# EAGLE schematic io_breakout-ver2.1 (EAGLE 9.4.2)

## Sheet 1 of 4
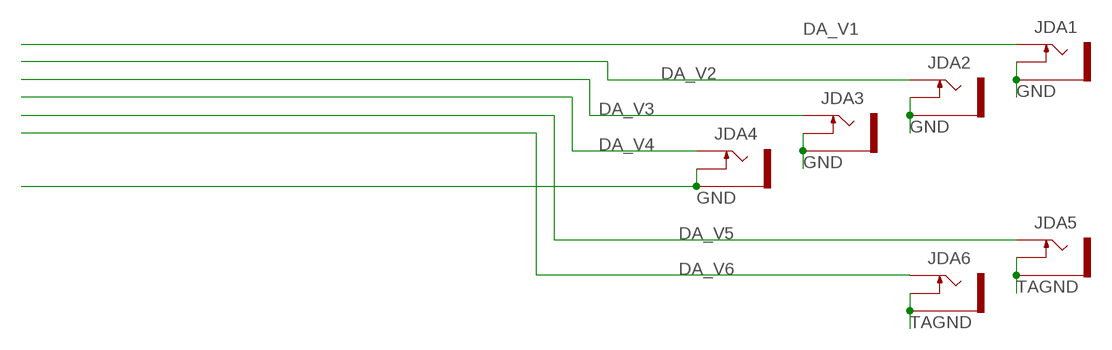
[diagram p0: schematic, sheet 1]

### Parts
JDA1  THONKICONNNEW  [WQP-PJ301M-12_JACK]
JDA2  THONKICONNNEW  [WQP-PJ301M-12_JACK]
JDA3  THONKICONNNEW  [WQP-PJ301M-12_JACK]
JDA4  THONKICONNNEW  [WQP-PJ301M-12_JACK]
JDA5  THONKICONNNEW  [WQP-PJ301M-12_JACK]
JDA6  THONKICONNNEW  [WQP-PJ301M-12_JACK]

### Nets
DA_V1 [defaultxx]: JDA1.P$1_TIP(TIP) ; also sheet 3
DA_V2 [defaultxx]: JDA2.P$1_TIP(TIP) ; also sheet 3
DA_V3 [defaultxx]: JDA3.P$1_TIP(TIP) ; also sheet 3
DA_V4 [defaultxx]: JDA4.P$1_TIP(TIP) ; also sheet 3
DA_V5: JDA5.P$1_TIP(TIP) ; also sheet 3
DA_V6: JDA6.P$1_TIP(TIP) ; also sheet 3
GND: JDA1.P$2_SWITCH(SWITCH) JDA1.P$3_SLEEVE(SLEEVE) JDA2.P$2_SWITCH(SWITCH) JDA2.P$3_SLEEVE(SLEEVE) JDA3.P$2_SWITCH(SWITCH) JDA3.P$3_SLEEVE(SLEEVE) JDA4.P$2_SWITCH(SWITCH) JDA4.P$3_SLEEVE(SLEEVE) ; also sheet 2,3,4
TAGND: JDA5.P$2_SWITCH(SWITCH) JDA5.P$3_SLEEVE(SLEEVE) JDA6.P$2_SWITCH(SWITCH) JDA6.P$3_SLEEVE(SLEEVE) ; also sheet 2,3

## Sheet 2 of 4
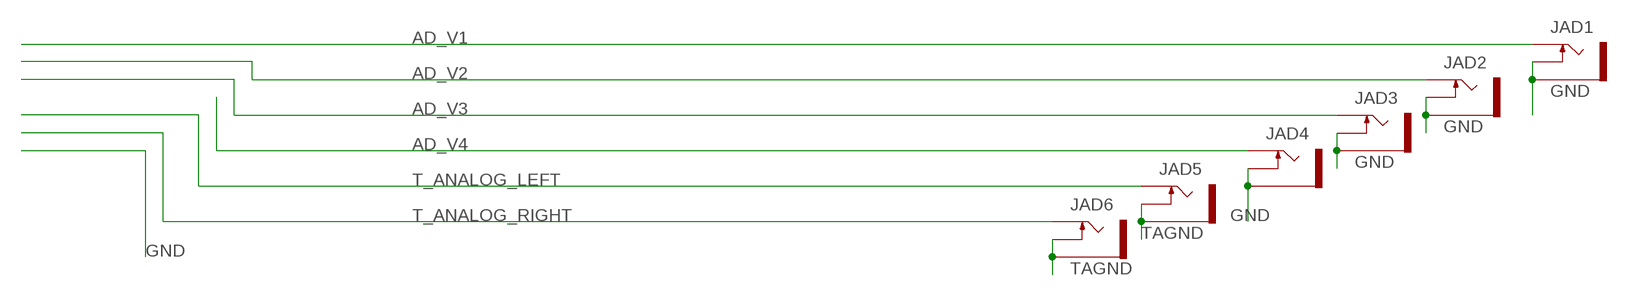
[diagram p1: schematic, sheet 2]

### Parts
JAD1  THONKICONNNEW  [WQP-PJ301M-12_JACK]
JAD2  THONKICONNNEW  [WQP-PJ301M-12_JACK]
JAD3  THONKICONNNEW  [WQP-PJ301M-12_JACK]
JAD4  THONKICONNNEW  [WQP-PJ301M-12_JACK]
JAD5  THONKICONNNEW  [WQP-PJ301M-12_JACK]
JAD6  THONKICONNNEW  [WQP-PJ301M-12_JACK]

### Nets
AD_V1: JAD1.P$1_TIP(TIP) ; also sheet 3
AD_V2 [defaultxx]: JAD2.P$1_TIP(TIP) ; also sheet 3
AD_V3 [defaultxx]: JAD3.P$1_TIP(TIP) ; also sheet 3
AD_V4 [defaultxx]: JAD4.P$1_TIP(TIP) ; also sheet 3
GND: JAD1.P$2_SWITCH(SWITCH) JAD1.P$3_SLEEVE(SLEEVE) JAD2.P$2_SWITCH(SWITCH) JAD2.P$3_SLEEVE(SLEEVE) JAD3.P$2_SWITCH(SWITCH) JAD3.P$3_SLEEVE(SLEEVE) JAD4.P$2_SWITCH(SWITCH) JAD4.P$3_SLEEVE(SLEEVE) ; also sheet 1,3,4
T_ANALOG_LEFT: JAD5.P$1_TIP(TIP) ; also sheet 3
T_ANALOG_RIGHT: JAD6.P$1_TIP(TIP) ; also sheet 3
TAGND: JAD5.P$2_SWITCH(SWITCH) JAD5.P$3_SLEEVE(SLEEVE) JAD6.P$2_SWITCH(SWITCH) JAD6.P$3_SLEEVE(SLEEVE) ; also sheet 1,3

## Sheet 3 of 4
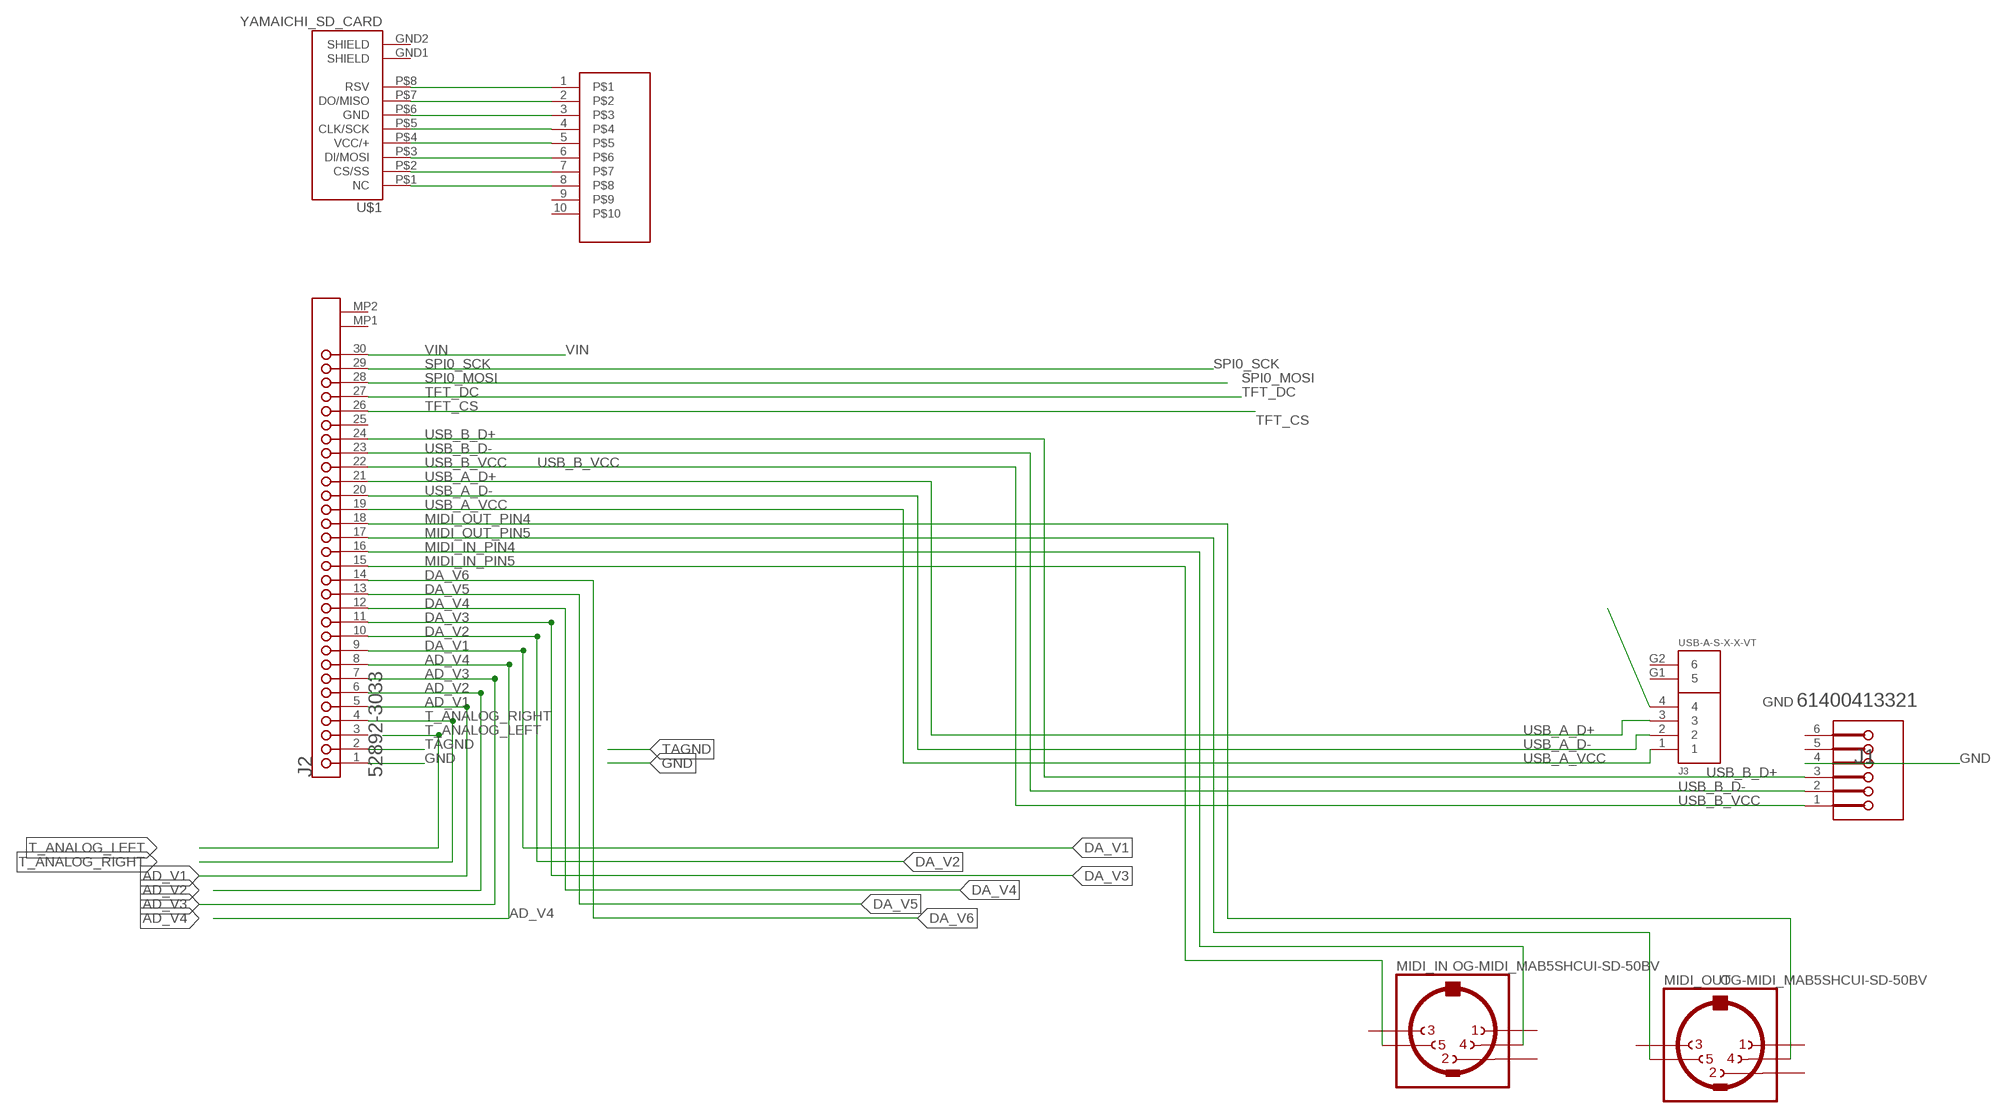
[diagram p2: schematic, sheet 3]

### Parts
J1  WURTH_ELECTRONICS_61400413321WURTH_ELECTRONICS_61400413321_0_0  [WURTH_ELECTRONICS_61400413321_0]
J2  MOLEX_52892-3033MOLEX_52892-3033_0_0  [MOLEX_52892-3033_0]
J3  USB-A-S-X-X-VT  [USB-A-S-X-X-VT]
MIDI_IN  OG-MIDI_MAB5SHCUI-SD-50BV  [OG-MIDI_SD-50BV]
MIDI_OUT  OG-MIDI_MAB5SHCUI-SD-50BV  [OG-MIDI_SD-50BV]
U$1  YAMAICHI_SD_CARD  [YAMAICHI_MICROSD_VERTICAL]
U$2  1734592-8  [TE_1-1734592-8]

### Nets
AD_V1: J2.5 ; also sheet 2
AD_V2 [defaultxx]: J2.6 ; also sheet 2
AD_V3 [defaultxx]: J2.7 ; also sheet 2
AD_V4 [defaultxx]: J2.8 ; also sheet 2
DA_V1 [defaultxx]: J2.9 ; also sheet 1
DA_V2 [defaultxx]: J2.10 ; also sheet 1
DA_V3 [defaultxx]: J2.11 ; also sheet 1
DA_V4 [defaultxx]: J2.12 ; also sheet 1
DA_V5: J2.13 ; also sheet 1
DA_V6: J2.14 ; also sheet 1
GND: J1.4 J2.1 J3.4 ; also sheet 1,2,4
MIDI_IN_PIN4: J2.16 MIDI_IN.4
MIDI_IN_PIN5: J2.15 MIDI_IN.5
MIDI_OUT_PIN4: J2.18 MIDI_OUT.4
MIDI_OUT_PIN5: J2.17 MIDI_OUT.5
N$1: U$1.P$8(RSV) U$2.1
N$2: U$1.P$7(DO/MISO) U$2.2
N$3: U$1.P$6(GND) U$2.3
N$4: U$1.P$5(CLK/SCK) U$2.4
N$5: U$1.P$3(DI/MOSI) U$2.6
N$6: U$1.P$4(VCC/+) U$2.5
N$7: U$1.P$2(CS/SS) U$2.7
N$8: U$1.P$1(NC) U$2.8
SPI0_MOSI [defaultxx]: J2.28 ; also sheet 4
SPI0_SCK [defaultxx]: J2.29 ; also sheet 4
T_ANALOG_RIGHT: J2.4 ; also sheet 2
TAGND: J2.2 ; also sheet 1,2
TFT_CS [defaultxx]: J2.26 ; also sheet 4
TFT_DC [defaultxx]: J2.27 ; also sheet 4
USB_A_D+: J2.21 J3.3
USB_A_D-: J2.20 J3.2
USB_A_VCC: J2.19 J3.1
USB_B_D+: J1.3 J2.24
USB_B_D-: J1.2 J2.23
USB_B_VCC: J1.1 J2.22
VIN: J2.30 ; also sheet 4
Unconnected: J1.5(MNT_1) J1.6(MNT_2) J2.3 J2.25 J2.MP1 J2.MP2 J3.G1 J3.G2 MIDI_IN.1 MIDI_IN.2 MIDI_IN.3 MIDI_OUT.1 MIDI_OUT.2 MIDI_OUT.3 U$1.GND1(SHIELD) U$1.GND2(SHIELD) U$2.9 U$2.10

## Sheet 4 of 4
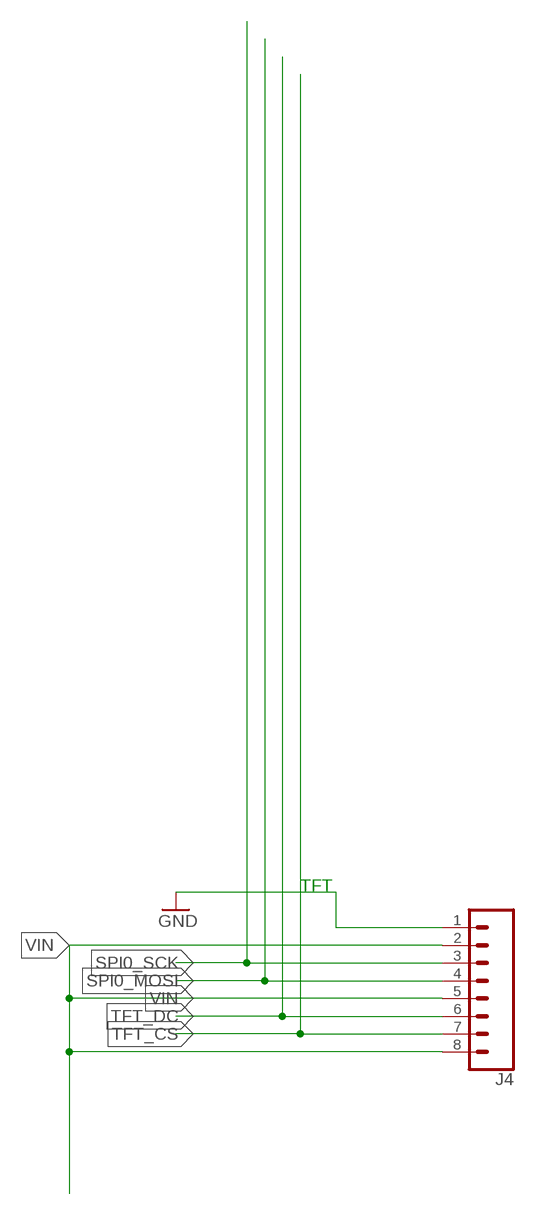
[diagram p3: schematic, sheet 4]

### Parts
J4  ST7735_1.4  [ST7735]

### Nets
GND: J4.1(GND) ; also sheet 1,2,3
SPI0_MOSI [defaultxx]: J4.4(SDA) ; also sheet 3
SPI0_SCK [defaultxx]: J4.3(SCL) ; also sheet 3
TFT_CS [defaultxx]: J4.7(CS) ; also sheet 3
TFT_DC [defaultxx]: J4.6(DC) ; also sheet 3
VIN: J4.2(VCC) J4.5(RESET) J4.8(BACKLIGHT) ; also sheet 3

### Notes on the sheet
- TFT

## Library data of the parts
J1 = Wurth Electronics - 61400413321:WURTH_ELECTRONICS_61400413321: CONN USB 4POS FEMALE STR TYPE B; AUTOMOTIVE: No; CENTROID_NOT_SPECIFIED: No; CONN_ORIENTATION: Vertical; CONTACT_MATERIAL: Gold; CURRENT_RATING: 1.5A; DATASHEET: https://katalog.we-online.com/em/datasheet/61400413321.pdf; DEVICE_CLASS_L1: Connectors; DEVICE_CLASS_L2: USB Connectors; DEVICE_CLASS_L3: unset; DIGIKEY_DESCRIPTION: CONN RCPT USB2.0 TYPEB 4POS VERT; DIGIKEY_PART_NUMBER: 732-2734-ND; FOOTPRINT_VARIANT_NAME_0: Recommended_Land_Pattern; HEIGHT: 16.3mm; IS_FEMALE: yes; LEAD_FREE: Yes; MF: Wurth Electronics; MFG_PACKAGE_IDENT: 61400413321; MFG_PACKAGE_IDENT_DATE: 0; MFG_PACKAGE_IDENT_REV: 0; MOUSER_DESCRIPTION: USB Connectors WR-COM USB Type B 4P CONN Female; MOUSER_PART_NUMBER: 710-61400413321; MPN: 61400413321; NUMBER_OF_CONTACTS: 4; PACKAGE: CONN_PTH_USB_B_VERT; PITCH: 2.5mm; PREFIX: J; ROHS: Yes; SHIELDING: true; TEMPERATURE_RANGE_HIGH: +105°C; TEMPERATURE_RANGE_LOW: -40°C; USB_STANDARD: USB 2.0; VERIFICATION_VERSION: 0.0.0.1; VOLTAGE_RATING: 30V
J2 = Molex - 52892-3033:MOLEX_52892-3033: MOLX-52892-3033; CIIVA_IDS: 12958047; CIRCUITS_LOADED: 30; COMPONENT_LINK_1_DESCRIPTION: Manufacturer URL; COMPONENT_LINK_1_URL: http://www.molex.com/molex/index.jsp; COMPONENT_LINK_3_DESCRIPTION: Package Specification; COMPONENT_LINK_3_URL: http://www.molex.com/pdm_docs/sd/528923033_sd.pdf; CONTACT_POSITION: Bottom; CURRENT_MAX_PER_CONTACT: 0.5A; DATASHEET: http://www.molex.com/webdocs/datasheets/pdf/en-us/0528923033_FFC_FPC_CONNECTORS.pdf; DURABILITY_MATING_CYCLES_MAX: 20; ENTRY_ANGLE: 90degrees Angle; FOOTPRINT_VARIANT_NAME_0: Manufacturer Recommended; IMPORTED: yes; IMPORTED_FROM: vault; IMPORT_TS: 1521848668; MATED_HEIGHT: 2.00mm; MATERIAL___METAL: Phosphor Bronze; MATERIAL___PLATING_MATING: Silver, Tin-Bismuth; MATERIAL___PLATING_TERMINATION: Silver, Tin-Bismuth; MF: Molex; MOUNTING_TECHNOLOGY: Surface Mount; MPN: 52892-3033; NUMBER_OF_ROWS: 1; ORIENTATION: Right Angle; PACKAGE: 52892-3033; PACKAGE_DESCRIPTION: 30-Lead FPC Connector, Pitch 0.5 mm; PACKAGE_VERSION: Rev. A, 05/2013; PACKING: Tape and Reel; PCB_LOCATOR: No; PCB_RETENTION: Yes; PITCH___MATING_INTERFACE: 0.50mm; PITCH___TERMINATION_INTERFACE: 0.50mm; POLARIZED_TO_PCB: No; PREFIX: J; RELEASE_DATE: 1411387070; ROHS: Yes; STACKABLE: No; VAULT_GUID: 0169C182-1258-4790-B51B-8D965E90A908; VAULT_REVISION: 36DEA303-18DB-4C92-B706-163F4C1D6A90; VOLTAGE_MAX: 50V
J3 = USB-A-S-X-X-VT:USB-A-S-X-X-VT: USB A, SINGLE, VERTICAL THROUGH HOLE.; AVAILABILITY: Unavailable; DESCRIPTION: Conn USB 2.0 Type A RCP 4 POS 2mm/2.5mm Solder ST Thru-Hole 4 Terminal 1 Port Tray; MF: Samtec; MP: USB-A-S-S-W-VT; PACKAGE: None; PRICE: None
J4 = SparkFun-Connectors-with-tft:ST7735_1.4: Multi connection point. Often used as Generic Header-pin footprint for 0.1 inch spaced/style header connections On any of the 0.1 inch spaced packages, you can populate with these: Break Away Headers - Straight <https://www.sparkfun.com/products/116> (PRT-00116) Break Away Male Headers - Right Angle <https://www.sparkfun.com/products/553> (PRT-00553) Female Headers <https://www.sparkfun.com/products/115> (PRT-00115) Break Away Headers - Machine Pin <https://www.sparkfun.com/products/117> (PRT-00117) Break Away Female Headers - Swiss Machine Pin <https://www.sparkfun.com/products/743> (PRT-00743) Arduino Stackable Header - 8 Pin <https://www.sparkfun.com/products/9279> (PRT-09279) For SCREWTERMINALS and SPRING TERMINALS visit here: Screw Terimnals on SparkFun.com <https://www.sparkfun.com/search/results?term=Screw+Terminals> (5mm/3.5mm/2.54mm spacing) This device is also useful as a general connection point to wire up your design to another part of your project. Our various solder wires solder well into these plated through hole pads. Hook-Up Wire - Assortment (Stranded, 22 AWG) <https://www.sparkfun.com/products/11375> (PRT-11375) Hook-Up Wire - Assortment (Solid Core, 22 AWG) <https://www.sparkfun.com/products/11367> (PRT-11367) View the entire wire category on our website here <https://www.sparkfun.com/categories/141> Special notes: Molex polarized connector foot print use with SKU : PRT-08231 with associated crimp pins and housings. 1MM SMD Version SKU: PRT-10208 NOTES ON THE VARIANTS LOCK and LOCK_LONGPADS... This footprint was designed to help hold the alignment of a through-hole component (i.e. 6-pin header) while soldering it into place. You may notice that each hole has been shifted either up or down by 0.005 of an inch from it's more standard position (which is a perfectly straight line). This slight alteration caused the pins (the squares in the middle) to touch the edges of the holes. Because they are alternating, it causes a "brace" to hold the component in place. 0.005 has proven to be the perfect amount of "off-center" position when using our standard breakaway headers. Although looks a little odd when you look at the bare footprint, once you have a header in there, the alteration is very hard to notice. Also,if you push a header all the way into place, it is covered up entirely on the bottom side.
JAD1-JAD6 JDA1-JDA6 = MusicThingModular:THONKICONN: 3.5mm socket for Eurorack modular synths
MIDI_IN MIDI_OUT = midi-connectors:OG-MIDI_MAB5SH: Female CONNECTOR 5 pins 90 deg. with shield, horizontal (DIN 41524)
U$1 = MusicThingModular:YAMAICHI_SD_CARD: Vertical SD Card Holder
U$2 = TE - 1-1734592-0:1734592-8

## Module STEREO_IN
Ports: LEFT_OUT(out) RIGHT_OUT(out) AGND(out)

### Library data of the parts

## Module STEREO_OUT
Ports: LEFT(out) RIGHT(out) AGND(out)

### Library data of the parts

## Net classes
0 POWERxx: width 0.229 mm
1 defaultxx: width 0.203 mm, drill 0.127 mm, clearance 0.127 mm